# EAGLE board 8x8 LED Cathode Base V5 (EAGLE 6.1), part 1 of 2
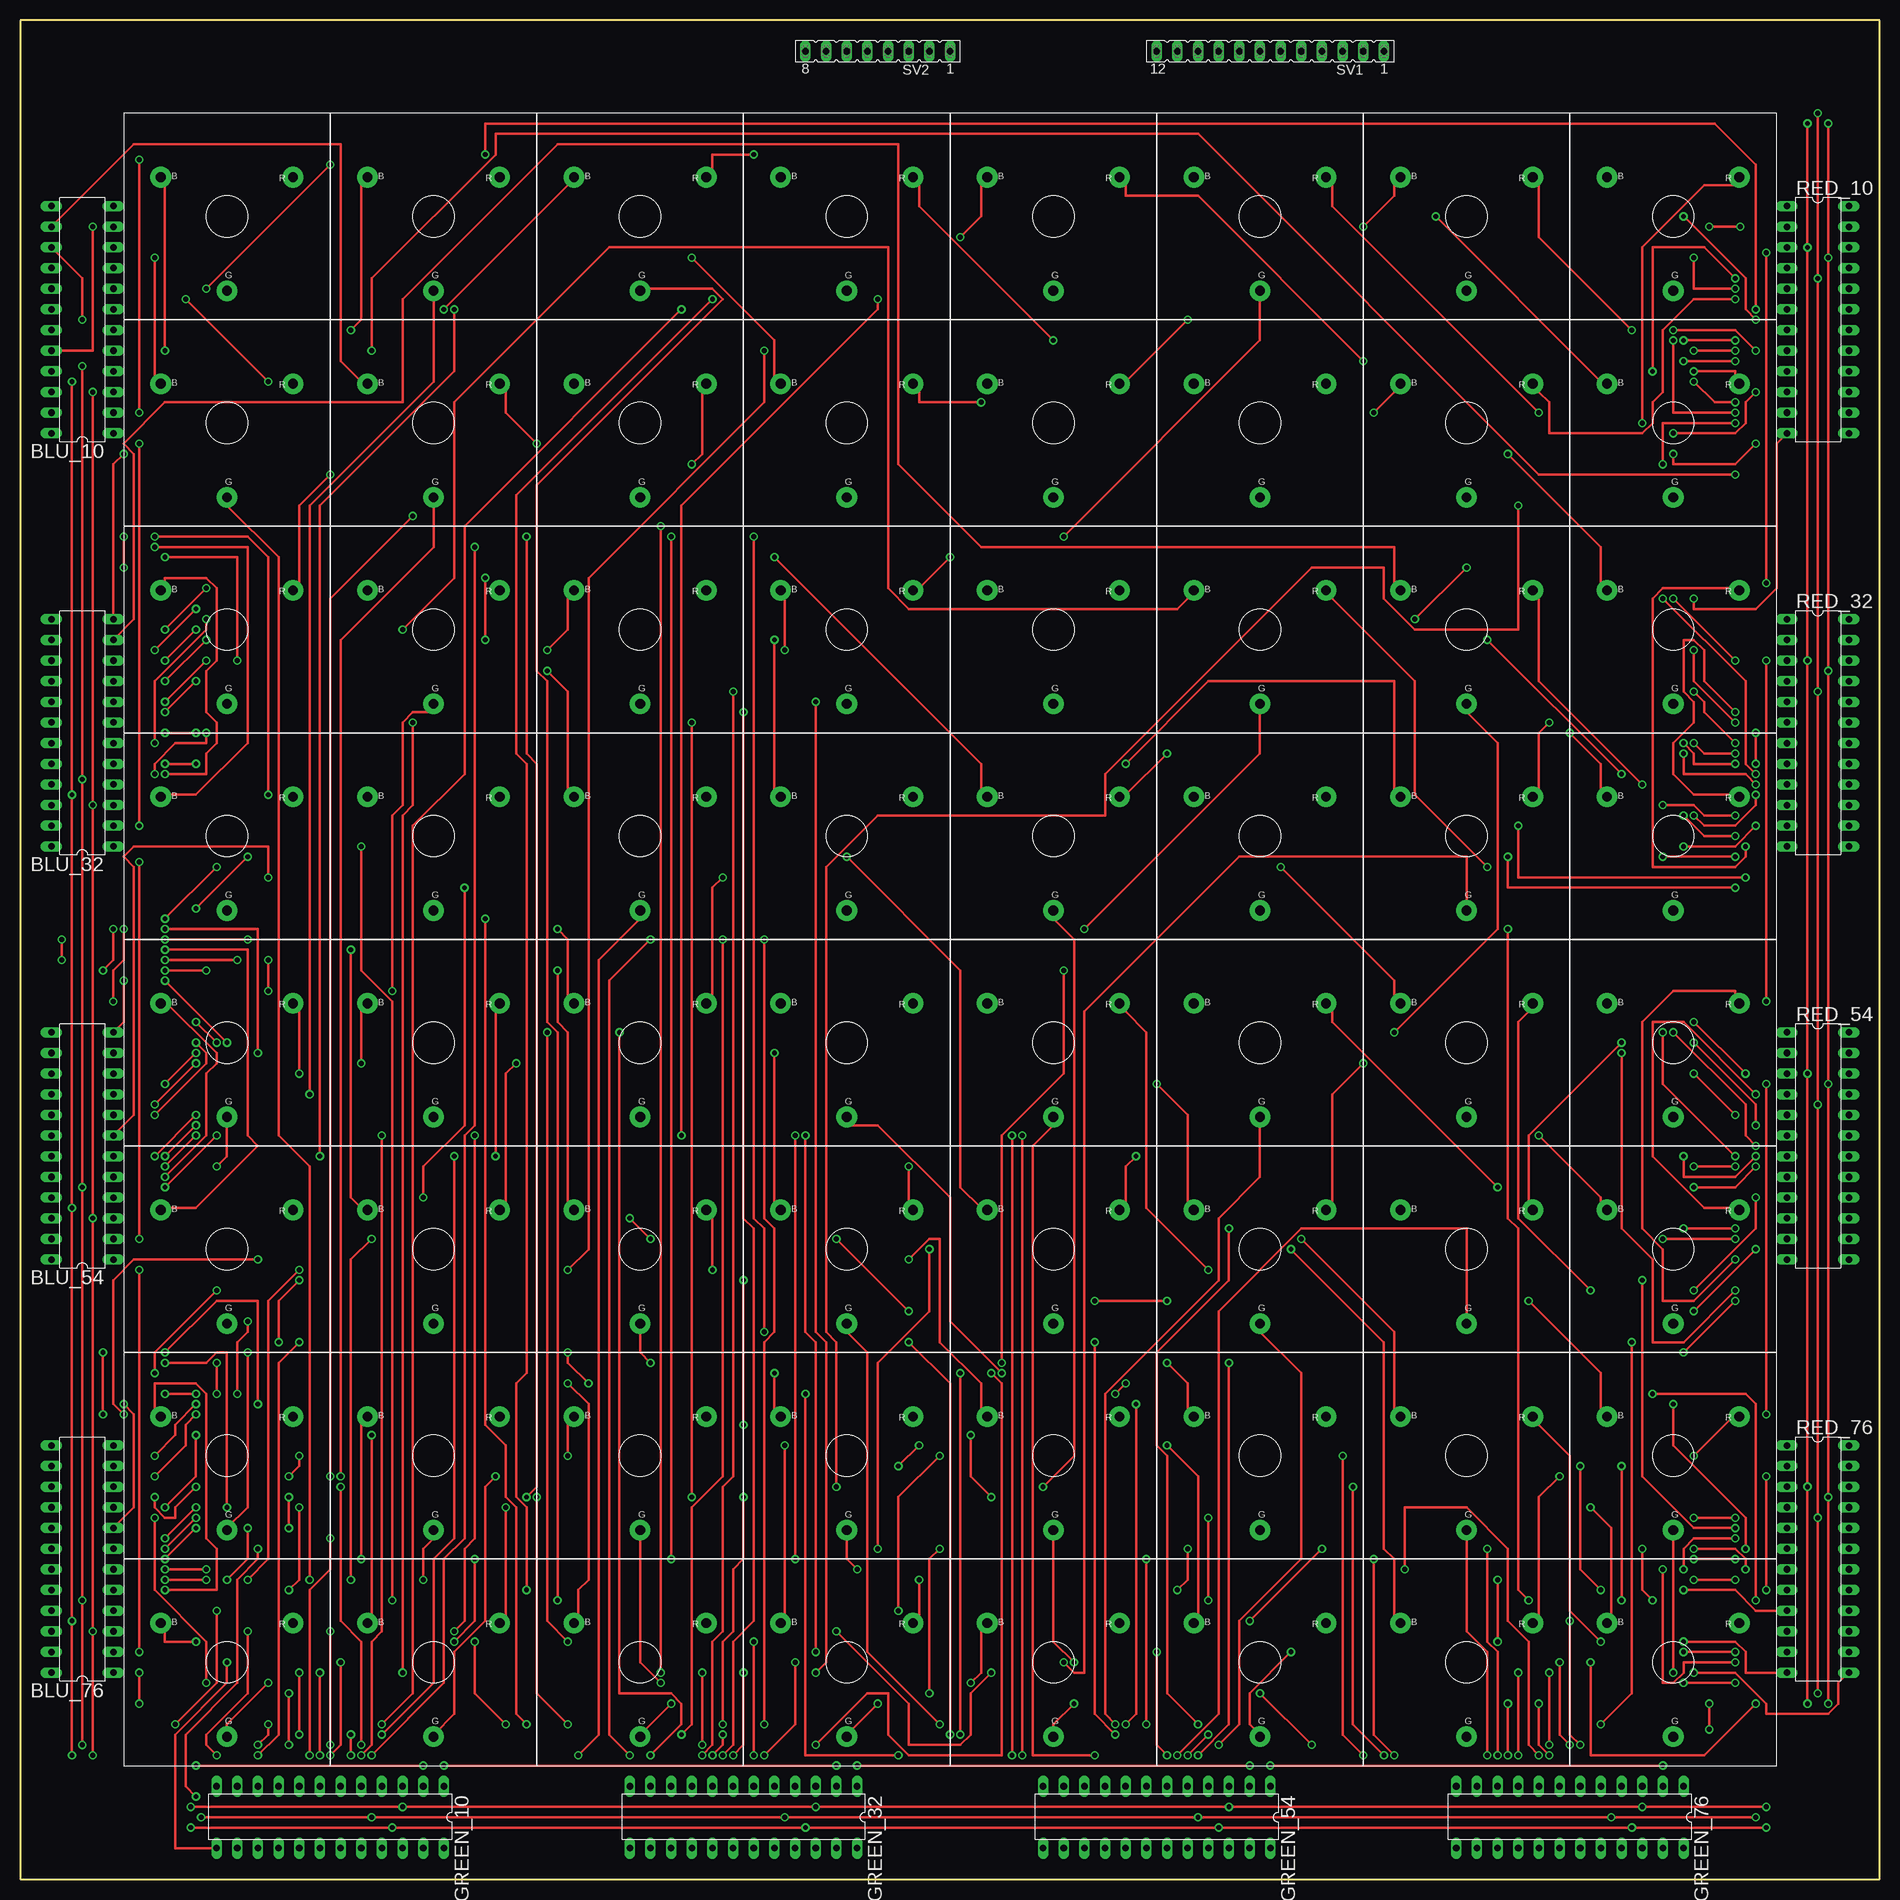
[diagram p1: board, top side]
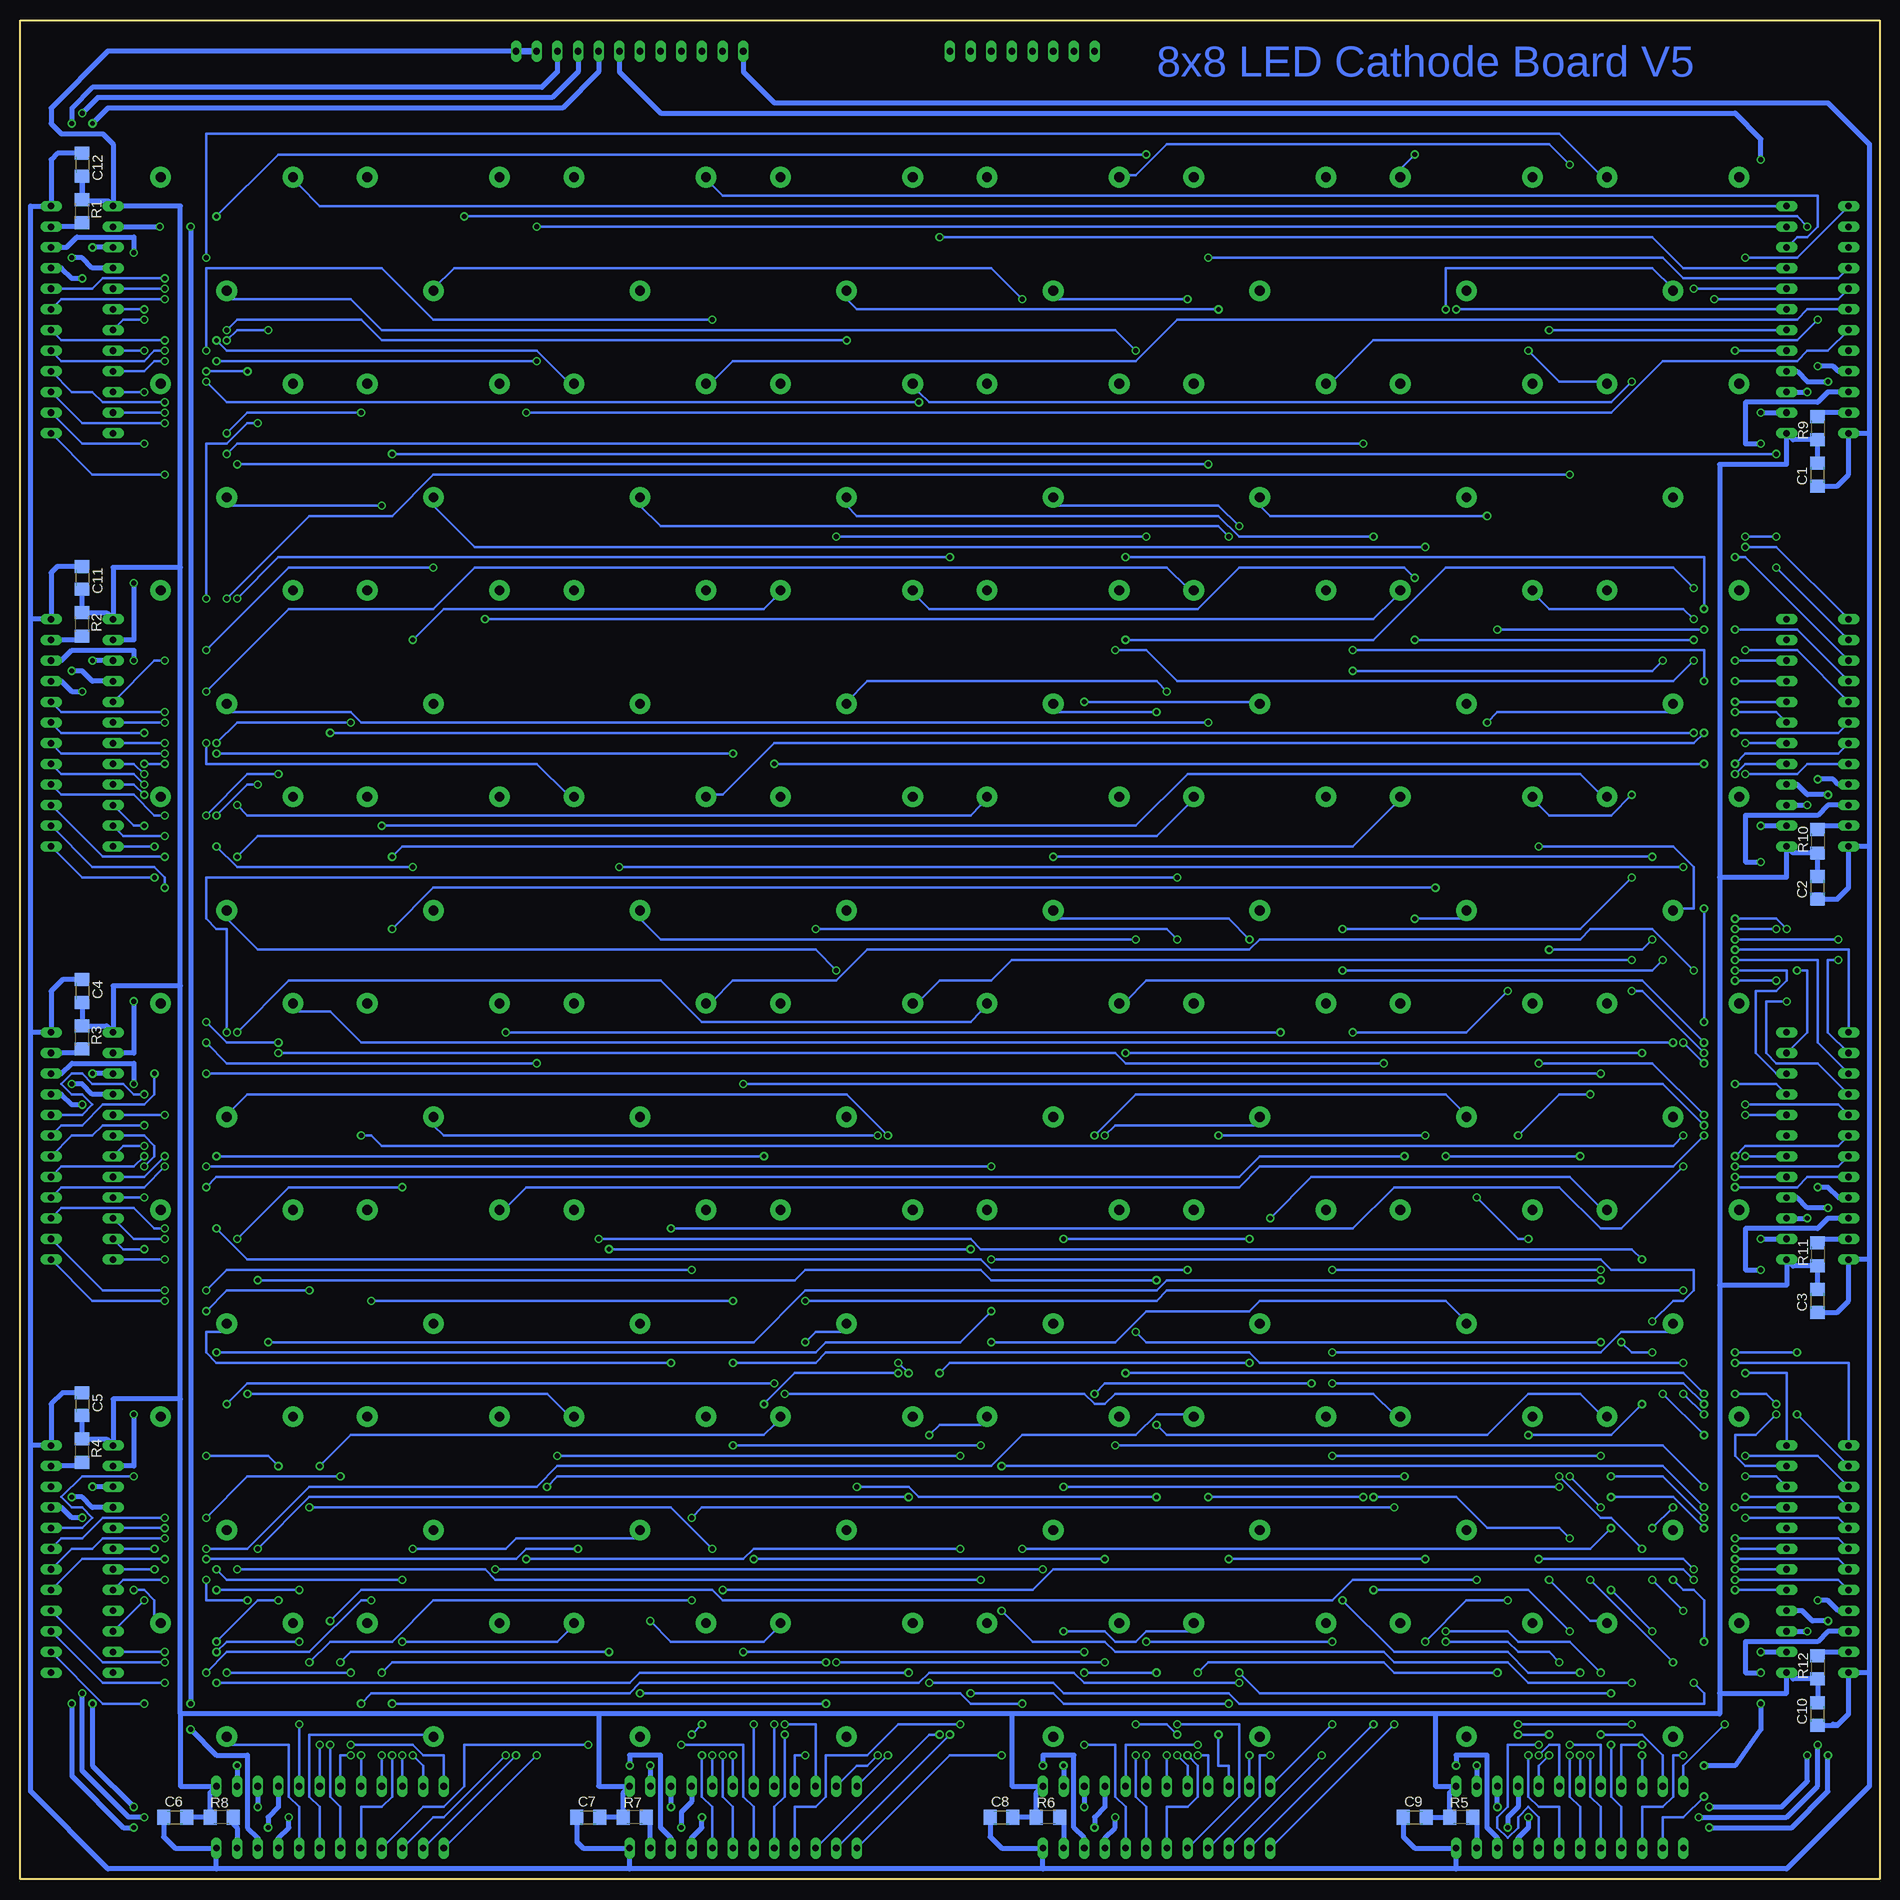
[diagram p2: board, bottom side, seen from below]

Size 228.58 x 228.58 mm. Coordinates in mm from the lower left corner, seen from the top.
Outline: 0,0 228.58,0 228.58,228.59 0,228.59 0,0
Copper layers (1*16): Top 0.035mm / dielectric 1.5mm / Bottom 0.035mm
Design rules: minimum track width 12mil, minimum drill 0.6mm, track to track 8mil, track to pad 8mil, pad to pad 8mil, via to via 8mil, smd to smd 8mil, copper to edge 40mil, drill to drill 8mil, minimum pad ring 10mil, minimum via ring 8mil, stop-mask expansion 4mil, vias tented up to drill 0mil, thermal gap 10mil

## Footprints (pad centres in the part's own frame; a part is rotated, then mirrored left to right if it is on the bottom)
DIL24-3 = drill 0.813 long: 1 -13.97,-3.81; 2 -11.43,-3.81; 3 -8.89,-3.81; 4 -6.35,-3.81; 5 -3.81,-3.81; 6 -1.27,-3.81; 7 1.27,-3.81; 8 3.81,-3.81; 9 6.35,-3.81; 10 8.89,-3.81; 11 11.43,-3.81; 12 13.97,-3.81; 13 13.97,3.81; 14 11.43,3.81; 15 8.89,3.81; 16 6.35,3.81; 17 3.81,3.81; 18 1.27,3.81; 19 -1.27,3.81; 20 -3.81,3.81; 21 -6.35,3.81; 22 -8.89,3.81; 23 -11.43,3.81; 24 -13.97,3.81
C1206 = smd 1.6 x 1.8: 1 -1.4,0; 2 1.4,0
R1206 = smd 1.6 x 1.803: 1 -1.422,0; 2 1.422,0
FE12 = drill 0.813 long: 1 -13.97,0; 2 -11.43,0; 3 -8.89,0; 4 -6.35,0; 5 -3.81,0; 6 -1.27,0; 7 1.27,0; 8 3.81,0; 9 6.35,0; 10 8.89,0; 11 11.43,0; 12 13.97,0
FE08 = drill 0.813 long: 1 -8.89,0; 2 -6.35,0; 3 -3.81,0; 4 -1.27,0; 5 1.27,0; 6 3.81,0; 7 6.35,0; 8 8.89,0
8X8_RGB_LED_120 = drill 1.2 pad 2.54: BLU_00 -97.028,93.726; BLU_01 -71.628,93.726; BLU_02 -46.228,93.726; BLU_03 -20.828,93.726; BLU_04 4.572,93.726; BLU_05 29.972,93.726; BLU_06 55.372,93.726; BLU_07 80.772,93.726; BLU_10 -97.028,68.326; BLU_11 -71.628,68.326; BLU_12 -46.228,68.326; BLU_13 -20.828,68.326; BLU_14 4.572,68.326; BLU_15 29.972,68.326; BLU_16 55.372,68.326; BLU_17 80.772,68.326; BLU_20 -97.028,42.926; BLU_21 -71.628,42.926; BLU_22 -46.228,42.926; BLU_23 -20.828,42.926; BLU_24 4.572,42.926; BLU_25 29.972,42.926; BLU_26 55.372,42.926; BLU_27 80.772,42.926; BLU_30 -97.028,17.526; BLU_31 -71.628,17.526; BLU_32 -46.228,17.526; BLU_33 -20.828,17.526; BLU_34 4.572,17.526; BLU_35 29.972,17.526; BLU_36 55.372,17.526; BLU_37 80.772,17.526; BLU_40 -97.028,-7.874; BLU_41 -71.628,-7.874; BLU_42 -46.228,-7.874; BLU_43 -20.828,-7.874; BLU_44 4.572,-7.874; BLU_45 29.972,-7.874; BLU_46 55.372,-7.874; BLU_47 80.772,-7.874; BLU_50 -97.028,-33.274; BLU_51 -71.628,-33.274; BLU_52 -46.228,-33.274; BLU_53 -20.828,-33.274; BLU_54 4.572,-33.274; BLU_55 29.972,-33.274; BLU_56 55.372,-33.274; BLU_57 80.772,-33.274; BLU_60 -97.028,-58.674; BLU_61 -71.628,-58.674; BLU_62 -46.228,-58.674; BLU_63 -20.828,-58.674; BLU_64 4.572,-58.674; BLU_65 29.972,-58.674; BLU_66 55.372,-58.674; BLU_67 80.772,-58.674; BLU_70 -97.028,-84.074; BLU_71 -71.628,-84.074; BLU_72 -46.228,-84.074; BLU_73 -20.828,-84.074; BLU_74 4.572,-84.074; BLU_75 29.972,-84.074; BLU_76 55.372,-84.074; BLU_77 80.772,-84.074; GRN_00 -88.9,79.756; GRN_01 -63.5,79.756; GRN_02 -38.1,79.756; GRN_03 -12.7,79.756; GRN_04 12.7,79.756; GRN_05 38.1,79.756; GRN_06 63.5,79.756; GRN_07 88.9,79.756; GRN_10 -88.9,54.356; GRN_11 -63.5,54.356; GRN_12 -38.1,54.356; GRN_13 -12.7,54.356; GRN_14 12.7,54.356; GRN_15 38.1,54.356; GRN_16 63.5,54.356; GRN_17 88.9,54.356; GRN_20 -88.9,28.956; GRN_21 -63.5,28.956; GRN_22 -38.1,28.956; GRN_23 -12.7,28.956; GRN_24 12.7,28.956; GRN_25 38.1,28.956; GRN_26 63.5,28.956; GRN_27 88.9,28.956; GRN_30 -88.9,3.556; GRN_31 -63.5,3.556; GRN_32 -38.1,3.556; GRN_33 -12.7,3.556; GRN_34 12.7,3.556; GRN_35 38.1,3.556; GRN_36 63.5,3.556; GRN_37 88.9,3.556; GRN_40 -88.9,-21.844; GRN_41 -63.5,-21.844; GRN_42 -38.1,-21.844; GRN_43 -12.7,-21.844; GRN_44 12.7,-21.844; GRN_45 38.1,-21.844; GRN_46 63.5,-21.844; GRN_47 88.9,-21.844; GRN_50 -88.9,-47.244; GRN_51 -63.5,-47.244; GRN_52 -38.1,-47.244; GRN_53 -12.7,-47.244; GRN_54 12.7,-47.244; GRN_55 38.1,-47.244; GRN_56 63.5,-47.244; GRN_57 88.9,-47.244; GRN_60 -88.9,-72.644; GRN_61 -63.5,-72.644; GRN_62 -38.1,-72.644; GRN_63 -12.7,-72.644; GRN_64 12.7,-72.644; GRN_65 38.1,-72.644; GRN_66 63.5,-72.644; GRN_67 88.9,-72.644; GRN_70 -88.9,-98.044; GRN_71 -63.5,-98.044; GRN_72 -38.1,-98.044; GRN_73 -12.7,-98.044; GRN_74 12.7,-98.044; GRN_75 38.1,-98.044; GRN_76 63.5,-98.044; GRN_77 88.9,-98.044; RED_00 -80.772,93.726; RED_01 -55.372,93.726; RED_02 -29.972,93.726; RED_03 -4.572,93.726; RED_04 20.828,93.726; RED_05 46.228,93.726; RED_06 71.628,93.726; RED_07 97.028,93.726; RED_10 -80.772,68.326; RED_11 -55.372,68.326; RED_12 -29.972,68.326; RED_13 -4.572,68.326; RED_14 20.828,68.326; RED_15 46.228,68.326; RED_16 71.628,68.326; RED_17 97.028,68.326; RED_20 -80.772,42.926; RED_21 -55.372,42.926; RED_22 -29.972,42.926; RED_23 -4.572,42.926; RED_24 20.828,42.926; RED_25 46.228,42.926; RED_26 71.628,42.926; RED_27 97.028,42.926; RED_30 -80.772,17.526; RED_31 -55.372,17.526; RED_32 -29.972,17.526; RED_33 -4.572,17.526; RED_34 20.828,17.526; RED_35 46.228,17.526; RED_36 71.628,17.526; RED_37 97.028,17.526; RED_40 -80.772,-7.874; RED_41 -55.372,-7.874; RED_42 -29.972,-7.874; RED_43 -4.572,-7.874; RED_44 20.828,-7.874; RED_45 46.228,-7.874; RED_46 71.628,-7.874; RED_47 97.028,-7.874; RED_50 -80.772,-33.274; RED_51 -55.372,-33.274; RED_52 -29.972,-33.274; RED_53 -4.572,-33.274; RED_54 20.828,-33.274; RED_55 46.228,-33.274; RED_56 71.628,-33.274; RED_57 97.028,-33.274; RED_60 -80.772,-58.674; RED_61 -55.372,-58.674; RED_62 -29.972,-58.674; RED_63 -4.572,-58.674; RED_64 20.828,-58.674; RED_65 46.228,-58.674; RED_66 71.628,-58.674; RED_67 97.028,-58.674; RED_70 -80.772,-84.074; RED_71 -55.372,-84.074; RED_72 -29.972,-84.074; RED_73 -4.572,-84.074; RED_74 20.828,-84.074; RED_75 46.228,-84.074; RED_76 71.628,-84.074; RED_77 97.028,-84.074

## Placement (x,y rotation side)
BLU_10  DM13A  [DIL24-3]  7.62,191.77 90 top
BLU_32  DM13A  [DIL24-3]  7.62,140.97 90 top
BLU_54  DM13A  [DIL24-3]  7.62,90.17 90 top
BLU_76  DM13A  [DIL24-3]  7.62,39.37 90 top
C1  105  [C1206]  7.62,172.72 90 bottom
C2  105  [C1206]  7.62,121.92 90 bottom
C3  105  [C1206]  7.62,71.12 90 bottom
C4  105  [C1206]  220.98,109.22 270 bottom
C5  105  [C1206]  220.98,58.42 270 bottom
C6  105  [C1206]  209.55,7.62 0 bottom
C7  105  [C1206]  158.75,7.62 0 bottom
C8  105  [C1206]  107.95,7.62 0 bottom
C9  105  [C1206]  57.15,7.62 0 bottom
C10  105  [C1206]  7.62,20.32 90 bottom
C11  105  [C1206]  220.98,160.02 270 bottom
C12  105  [C1206]  220.98,210.82 270 bottom
GREEN_10  DM13A  [DIL24-3]  38.1,7.62 180 top
GREEN_32  DM13A  [DIL24-3]  88.9,7.62 180 top
GREEN_54  DM13A  [DIL24-3]  139.7,7.62 180 top
GREEN_76  DM13A  [DIL24-3]  190.5,7.62 180 top
R1  2K7  [R1206]  220.98,205.1 270 bottom
R2  2K7  [R1206]  220.98,154.31 270 bottom
R3  2K7  [R1206]  220.98,103.5 270 bottom
R4  2K7  [R1206]  220.98,52.7 270 bottom
R5  2K7  [R1206]  51.44,7.62 0 bottom
R6  2K7  [R1206]  102.23,7.62 0 bottom
R7  2K7  [R1206]  153.03,7.62 0 bottom
R8  2K7  [R1206]  203.84,7.62 0 bottom
R9  2K7  [R1206]  7.62,178.44 90 bottom
R10  2K7  [R1206]  7.62,127.64 90 bottom
R11  2K7  [R1206]  7.62,76.83 90 bottom
R12  2K7  [R1206]  7.62,26.04 90 bottom
RED_10  DM13A  [DIL24-3]  220.98,191.77 270 top
RED_32  DM13A  [DIL24-3]  220.98,140.97 270 top
RED_54  DM13A  [DIL24-3]  220.98,90.17 270 top
RED_76  DM13A  [DIL24-3]  220.98,39.37 270 top
SV1  BOTTOM  [FE12]  153.67,224.79 180 top
SV2  [FE08]  105.41,224.79 180 top
U$1  8X8_RGB_COLUMN  [8X8_RGB_LED_120]  114.3,115.57 0 top

## Tracks (layer width: path | path; a pad name or v marks a point on that pad's centre or on a via)
BLANK  (via drill 0.6, 0.6 pad 1.02)
  Top 0.305: v7.62,186.06 v7.62,135.25 v7.62,85.09 v7.62,34.29 v7.62,16.51 | v22.23,7.62 v43.18,7.62 v93.98,7.62 v144.78,7.62 v195.58,7.62 v213.36,7.62 | v220.98,22.86 v220.98,44.45 v220.98,95.25 v220.98,146.05 v220.98,196.85 v220.98,217.17
  Bottom 0.61: BLU_10.21 5.08,185.42 5.71,186.06 v7.62,186.06 | BLU_32.21 5.08,134.62 5.71,135.25 v7.62,135.25 | BLU_76.21 5.08,33.02 6.35,34.29 v7.62,34.29 | BLU_54.21 5.08,83.82 6.35,85.09 v7.62,85.09 | v43.18,7.62 43.18,6.35 44.45,5.08 GREEN_10.21 | v22.23,7.62 11.43,7.62 7.62,11.43 v7.62,16.51 | GREEN_32.21 95.25,5.08 93.98,6.35 v93.98,7.62 | GREEN_54.21 146.05,5.08 144.78,6.35 v144.78,7.62 | GREEN_76.21 196.85,5.08 195.58,6.35 v195.58,7.62 | v213.36,7.62 215.26,7.62 220.98,13.34 v220.98,22.86 | v220.98,44.45 222.25,44.45 223.52,45.72 RED_76.21 | RED_54.21 223.52,96.52 222.25,95.25 v220.98,95.25 | RED_32.21 223.52,147.32 222.25,146.05 v220.98,146.05 | RED_10.21 223.52,198.12 222.25,196.85 v220.98,196.85 | SV1.4 160.02,222.25 163.19,219.07 219.07,219.07 v220.98,217.17
BLU_00  (via drill 0.6)
  Top 0.305: v17.78,187.96 17.78,208.28 U$1.BLU_00
  Bottom 0.305: v17.78,187.96 BLU_10.5
BLU_01  (via drill 0.6)
  Top 0.305: v40.64,190.5 41.91,191.77 41.91,208.28 U$1.BLU_01
  Bottom 0.305: v40.64,190.5 BLU_10.6
BLU_02  (via drill 0.6)
  Top 0.305: v52.07,193.04 67.31,208.28 U$1.BLU_02
  Bottom 0.305: v52.07,193.04 BLU_10.7
BLU_03  (via drill 0.6)
  Top 0.305: v38.1,210.82 v22.86,195.58
  Bottom 0.305: v22.86,195.58 BLU_10.8 | v38.1,210.82 40.64,213.36 87.63,213.36 91.44,209.55 92.71,209.55 U$1.BLU_03
BLU_04  (via drill 0.6)
  Top 0.305: v115.57,201.93 118.11,204.47 118.11,208.28 U$1.BLU_04
  Bottom 0.305: BLU_10.9 24.13,198.12 27.94,201.93 v115.57,201.93
BLU_05
  Bottom 0.305: BLU_10.10 10.16,201.93 8.89,201.93 7.62,203.2 7.62,207.01 142.24,207.01 143.51,208.28 U$1.BLU_05
BLU_06  (via drill 0.6)
  Top 0.305: v165.1,203.2 168.91,207.01 168.91,208.28 U$1.BLU_06
  Bottom 0.305: v165.1,203.2 BLU_10.11
BLU_07
  Bottom 0.305: BLU_10.12 191.77,205.74 194.31,208.28 U$1.BLU_07
BLU_10  (via drill 0.6)
  Top 0.305: v16.51,199.39 16.51,184.15 U$1.BLU_10
  Bottom 0.305: BLU_10.13 10.16,199.39 v16.51,199.39
BLU_11
  Top 0.305: BLU_10.14 13.97,213.36 39.37,213.36 39.37,186.69 41.91,184.15 U$1.BLU_11
BLU_12  (via drill 0.6)
  Top 0.305: BLU_10.15 7.62,196.85 v7.62,191.77
  Bottom 0.305: v7.62,191.77 10.16,189.23 62.23,189.23 67.31,184.15 U$1.BLU_12
BLU_13  (via drill 0.6)
  Top 0.305: v82.55,199.39 92.71,189.23 92.71,184.15 U$1.BLU_13
  Bottom 0.305: BLU_10.16 5.08,196.85 24.13,196.85 26.67,199.39 v82.55,199.39
BLU_14  (via drill 0.6)
  Top 0.305: v30.48,184.15 v20.32,194.31
  Bottom 0.305: BLU_10.17 5.08,194.31 v20.32,194.31 | v30.48,184.15 33.02,181.61 116.84,181.61 118.11,182.88 U$1.BLU_14
BLU_15
  Bottom 0.305: BLU_10.18 8.89,193.04 10.16,191.77 86.36,191.77 91.44,186.69 140.97,186.69 143.51,184.15 U$1.BLU_15
BLU_16  (via drill 0.6)
  Top 0.305: v166.37,180.34 168.91,182.88 U$1.BLU_16
  Bottom 0.305: BLU_10.19 6.35,187.96 8.89,187.96 10.16,186.69 26.67,186.69 33.02,180.34 v166.37,180.34
BLU_17  (via drill 0.6)
  Top 0.305: BLU_10.20 8.89,187.96 v8.89,203.2 | v173.99,204.47 194.31,184.15 U$1.BLU_17
  Bottom 0.305: v8.89,203.2 10.16,204.47 v173.99,204.47
BLU_20  (via drill 0.6)
  Top 0.305: v17.78,135.89 22.86,135.89 22.86,138.43 24.13,139.7 24.13,142.24 22.86,143.51 22.86,148.59 24.13,149.86 24.13,158.75 22.86,160.02 17.78,160.02 17.78,158.75 U$1.BLU_20
  Bottom 0.305: BLU_32.5 16.51,137.16 v17.78,135.89
BLU_21  (via drill 0.6)
  Top 0.305: v16.51,139.7 16.51,147.32 22.86,153.67 v22.86,154.94
  Bottom 0.305: v16.51,139.7 BLU_32.6 | v22.86,154.94 24.13,156.21 40.64,156.21 41.91,157.48 U$1.BLU_21
BLU_22  (via drill 0.6)
  Top 0.305: v21.59,147.32 v17.78,143.51 | v64.77,151.13 67.31,153.67 67.31,157.48 U$1.BLU_22
  Bottom 0.305: BLU_32.7 12.7,143.51 v17.78,143.51 | v21.59,147.32 21.59,151.13 v64.77,151.13
BLU_23  (via drill 0.6)
  Top 0.305: v22.86,149.86 v17.78,144.78 | v93.98,151.13 93.98,157.48 U$1.BLU_23
  Bottom 0.305: v17.78,144.78 BLU_32.8 | v22.86,149.86 25.4,147.32 86.36,147.32 90.17,151.13 v93.98,151.13
BLU_24  (via drill 0.6)
  Top 0.305: v22.86,152.4 v17.78,147.32 | v57.15,160.02 v57.15,152.4
  Bottom 0.305: v17.78,147.32 BLU_32.9 | v57.15,152.4 v22.86,152.4 | v57.15,160.02 58.42,161.29 78.74,161.29 83.82,156.21 116.84,156.21 118.11,157.48 U$1.BLU_24
BLU_25  (via drill 0.6)
  Top 0.305: v21.59,153.67 v17.78,149.86 | v46.99,153.67 53.34,160.02 53.34,181.61 72.39,200.66 106.68,200.66 106.68,158.75 109.22,156.21 142.24,156.21 143.51,157.48 U$1.BLU_25
  Bottom 0.305: v17.78,149.86 BLU_32.10 | v46.99,153.67 v21.59,153.67
BLU_26
  Top 0.305: BLU_32.11 13.97,154.94 13.97,175.26 12.7,176.53 17.78,181.61 46.99,181.61 46.99,194.31 66.04,213.36 107.95,213.36 107.95,173.99 118.11,163.83 168.91,163.83 168.91,158.75 U$1.BLU_26
BLU_27  (via drill 0.6)
  Top 0.305: BLU_32.12 11.43,173.99 v12.7,175.26 | v182.88,175.26 194.31,163.83 194.31,158.75 U$1.BLU_27
  Bottom 0.305: v182.88,175.26 v12.7,175.26
BLU_30  (via drill 0.6)
  Top 0.305: v16.51,163.83 27.94,163.83 27.94,139.7 21.59,133.35 17.78,133.35 U$1.BLU_30
  Bottom 0.305: BLU_32.13 12.7,163.83 v16.51,163.83
BLU_31  (via drill 0.6)
  Top 0.305: v12.7,165.1 v12.7,161.29 | v16.51,165.1 27.94,165.1 30.48,162.56 v30.48,133.35
  Bottom 0.305: v12.7,161.29 BLU_32.14 | v16.51,165.1 v12.7,165.1 | v30.48,133.35 33.02,130.81 40.64,130.81 41.91,132.08 U$1.BLU_31
BLU_32  (via drill 0.6)
  Top 0.305: v17.78,162.56 26.67,162.56 v26.67,149.86 | v64.77,148.59 67.31,146.05 67.31,133.35 U$1.BLU_32
  Bottom 0.305: BLU_32.15 16.51,162.56 v17.78,162.56 | v26.67,149.86 27.94,148.59 v64.77,148.59
BLU_32_DATA  (via drill 0.6 pad 1.02)
  Top 0.305: v14.61,176.53 v14.61,129.54
  Bottom 0.61: BLU_10.22 6.35,182.88 7.62,181.61 16.51,181.61 16.51,176.53 v14.61,176.53 | v14.61,129.54 BLU_32.2
BLU_33  (via drill 0.6)
  Top 0.305: v22.86,158.75 v17.78,153.67 | v92.71,152.4 92.71,133.35 U$1.BLU_33
  Bottom 0.305: BLU_32.16 10.16,153.67 v17.78,153.67 | v22.86,158.75 25.4,161.29 53.34,161.29 62.23,152.4 v92.71,152.4
BLU_34  (via drill 0.6)
  Top 0.305: v21.59,156.21 v16.51,151.13 | v92.71,162.56 118.11,137.16 118.11,133.35 U$1.BLU_34
  Bottom 0.305: BLU_32.17 10.16,151.13 v16.51,151.13 | v21.59,156.21 21.59,162.56 v92.71,162.56
BLU_35  (via drill 0.6)
  Top 0.305: v21.59,140.97 v17.78,140.97
  Bottom 0.305: BLU_32.18 5.08,140.97 v17.78,140.97 | v21.59,140.97 22.86,139.7 135.89,139.7 142.24,133.35 143.51,133.35 U$1.BLU_35
BLU_36  (via drill 0.6)
  Top 0.305: v21.59,137.16 v17.78,137.16 | v135.89,137.16 146.05,147.32 168.91,147.32 168.91,133.35 U$1.BLU_36
  Bottom 0.305: BLU_32.19 5.08,138.43 16.51,138.43 v17.78,137.16 | v135.89,137.16 v21.59,137.16
BLU_37  (via drill 0.6)
  Top 0.305: v16.51,135.89 16.51,137.16 19.05,139.7 22.86,139.7 v22.86,140.97 | v190.5,140.97 194.31,137.16 194.31,133.35 U$1.BLU_37
  Bottom 0.305: BLU_32.20 8.89,137.16 10.16,135.89 v16.51,135.89 | v190.5,140.97 v22.86,140.97
BLU_40  (via drill 0.6)
  Top 0.305: v17.78,86.36 22.86,91.44 22.86,99.06 24.13,100.33 24.13,101.6 17.78,107.95 U$1.BLU_40
  Bottom 0.305: v17.78,86.36 BLU_54.5
BLU_41  (via drill 0.6)
  Top 0.305: v21.59,93.98 v16.51,88.9 | v41.91,100.33 41.91,106.68 U$1.BLU_41
  Bottom 0.305: v16.51,88.9 BLU_54.6 | v21.59,93.98 27.94,100.33 v41.91,100.33
BLU_42  (via drill 0.6)
  Top 0.305: BLU_54.7 13.97,93.98 13.97,124.46 12.7,125.73 13.97,127 30.48,127 v30.48,123.19 | v66.04,116.84 67.31,115.57 67.31,107.95 U$1.BLU_42
  Bottom 0.305: v30.48,123.19 36.83,116.84 v66.04,116.84
BLU_43  (via drill 0.6)
  Top 0.305: v16.51,93.98 22.86,100.33 22.86,101.6 v21.59,102.87
  Bottom 0.305: v16.51,93.98 BLU_54.8 | v21.59,102.87 29.21,110.49 90.17,110.49 92.71,107.95 U$1.BLU_43
BLU_44  (via drill 0.6)
  Top 0.305: v21.59,101.6 v17.78,97.79 | v30.48,113.03 v30.48,109.22
  Bottom 0.305: BLU_54.9 12.7,97.79 v17.78,97.79 | v21.59,101.6 29.21,109.22 v30.48,109.22 | v30.48,113.03 106.68,113.03 109.22,110.49 115.57,110.49 118.11,107.95 U$1.BLU_44
BLU_45  (via drill 0.6)
  Top 0.305: v22.86,111.76 v17.78,111.76
  Bottom 0.305: BLU_54.10 12.7,99.06 15.24,101.6 15.24,109.22 12.7,109.22 11.43,110.49 11.43,111.76 v17.78,111.76 | v22.86,111.76 27.94,116.84 35.56,116.84 36.83,115.57 76.2,115.57 77.47,114.3 124.46,114.3 128.27,110.49 140.97,110.49 143.51,107.95 U$1.BLU_45
BLU_46  (via drill 0.6)
  Top 0.305: v10.16,111.76 11.43,113.03 v11.43,116.84 | v24.13,124.46 v17.78,118.11 | v154.94,124.46 168.91,110.49 168.91,107.95 U$1.BLU_46
  Bottom 0.305: BLU_54.11 8.89,104.14 8.89,111.76 v10.16,111.76 | v11.43,116.84 12.7,118.11 v17.78,118.11 | v154.94,124.46 v24.13,124.46
BLU_47  (via drill 0.6)
  Top 0.305: BLU_54.12 12.7,105.41 v12.7,110.49 | v25.4,102.87 v17.78,110.49
  Bottom 0.305: v17.78,110.49 v12.7,110.49 | v25.4,102.87 186.69,102.87 190.5,106.68 194.31,106.68 U$1.BLU_47
BLU_50  (via drill 0.6)
  Top 0.305: v17.78,114.3 27.94,114.3 27.94,91.44 29.21,90.17 21.59,82.55 17.78,82.55 U$1.BLU_50
  Bottom 0.305: BLU_54.13 3.81,114.3 v17.78,114.3
BLU_51  (via drill 0.6)
  Top 0.305: v5.08,115.57 v5.08,113.03 | v27.94,115.57 v17.78,115.57 | v40.64,114.3 40.64,83.82 41.91,82.55 U$1.BLU_51
  Bottom 0.305: BLU_54.14 6.35,104.14 6.35,113.03 v5.08,113.03 | v17.78,115.57 v5.08,115.57 | v27.94,115.57 29.21,114.3 v40.64,114.3
BLU_52  (via drill 0.6)
  Top 0.305: v26.67,113.03 v17.78,113.03 | v66.04,111.76 66.04,105.41 67.31,104.14 67.31,82.55 U$1.BLU_52
  Bottom 0.305: BLU_54.15 7.62,102.87 7.62,113.03 v17.78,113.03 | v26.67,113.03 27.94,111.76 v66.04,111.76
BLU_53  (via drill 0.6)
  Top 0.305: v11.43,107.95 11.43,111.76 12.7,113.03 v12.7,116.84 | v17.78,116.84 29.21,116.84 v29.21,101.6 | v92.71,101.6 92.71,82.55 U$1.BLU_53
  Bottom 0.305: BLU_54.16 7.62,100.33 12.7,100.33 13.97,101.6 13.97,107.95 v11.43,107.95 | v17.78,116.84 v12.7,116.84 | v92.71,101.6 v29.21,101.6
BLU_54  (via drill 0.6)
  Top 0.305: v21.59,100.33 v16.51,95.25 | v21.59,105.41 v24.13,102.87 | v27.94,125.73 v21.59,119.38 | v101.6,125.73 115.57,111.76 115.57,85.09 118.11,82.55 U$1.BLU_54
  Bottom 0.305: BLU_54.17 5.08,95.25 v16.51,95.25 | v24.13,102.87 v21.59,100.33 | v21.59,119.38 v21.59,105.41 | v101.6,125.73 v27.94,125.73
BLU_54_DATA  (via drill 0.6 pad 1.02)
  Top 0.305: v14.61,125.09 v14.61,78.74
  Bottom 0.61: BLU_32.22 6.35,132.08 7.62,130.81 16.51,130.81 16.51,125.09 v14.61,125.09 | v14.61,78.74 BLU_54.2
BLU_55  (via drill 0.6)
  Top 0.305: v21.59,92.71 v17.78,88.9 | v139.7,97.79 143.51,93.98 143.51,82.55 U$1.BLU_55
  Bottom 0.305: BLU_54.18 5.08,90.17 16.51,90.17 v17.78,88.9 | v21.59,92.71 26.67,97.79 v139.7,97.79
BLU_56  (via drill 0.6)
  Top 0.305: v21.59,91.44 v17.78,87.63
  Bottom 0.305: BLU_54.19 5.08,87.63 v17.78,87.63 | v21.59,91.44 25.4,87.63 76.2,87.63 78.74,85.09 166.37,85.09 168.91,82.55 U$1.BLU_56
BLU_57  (via drill 0.6)
  Top 0.305: v24.13,91.44 v17.78,85.09 | v186.69,91.44 194.31,83.82 194.31,82.55 U$1.BLU_57
  Bottom 0.305: BLU_54.20 8.89,86.36 10.16,85.09 v17.78,85.09 | v24.13,91.44 25.4,90.17 184.15,90.17 185.42,91.44 v186.69,91.44
BLU_60  (via drill 0.6)
  Top 0.305: v17.78,35.56 24.13,35.56 24.13,40.64 22.86,41.91 22.86,59.69 21.59,60.96 16.51,60.96 16.51,57.15 U$1.BLU_60
  Bottom 0.305: v17.78,35.56 BLU_76.5
BLU_61  (via drill 0.6)
  Top 0.305: v22.86,38.1 v17.78,38.1 | v41.91,39.37 41.91,55.88 U$1.BLU_61
  Bottom 0.305: v17.78,38.1 BLU_76.6 | v22.86,38.1 24.13,39.37 v41.91,39.37
BLU_62  (via drill 0.6)
  Top 0.305: v21.59,44.45 v17.78,40.64 | v33.02,49.53 34.29,50.8 v34.29,52.07 | v67.31,52.07 67.31,55.88 U$1.BLU_62
  Bottom 0.305: v17.78,40.64 BLU_76.7 | v21.59,44.45 26.67,49.53 v33.02,49.53 | v67.31,52.07 v34.29,52.07
BLU_63  (via drill 0.6)
  Top 0.305: BLU_76.8 13.97,45.72 13.97,57.15 v12.7,58.42 | v21.59,59.69 v17.78,59.69 | v92.71,62.23 92.71,57.15 U$1.BLU_63
  Bottom 0.305: v12.7,58.42 13.97,59.69 v17.78,59.69 | v21.59,59.69 24.13,62.23 v92.71,62.23
BLU_64  (via drill 0.6)
  Top 0.305: v17.78,45.72 21.59,49.53 v21.59,54.61 | v26.67,59.69 26.67,66.04 27.94,67.31 v27.94,68.58 | v109.22,76.2 111.76,78.74 113.03,78.74 113.03,66.04 118.11,60.96 118.11,57.15 U$1.BLU_64
  Bottom 0.305: v17.78,45.72 BLU_76.9 | v26.67,59.69 v21.59,54.61 | v27.94,68.58 25.4,71.12 24.13,71.12 22.86,72.39 22.86,74.93 33.02,74.93 34.29,76.2 v109.22,76.2
BLU_65  (via drill 0.6)
  Top 0.305: v16.51,49.53 20.32,53.34 20.32,55.88 v21.59,57.15 | v24.13,63.5 v24.13,59.69 | v140.97,63.5 143.51,60.96 143.51,57.15 U$1.BLU_65
  Bottom 0.305: BLU_76.10 12.7,49.53 v16.51,49.53 | v24.13,59.69 v21.59,57.15 | v24.13,63.5 76.2,63.5 77.47,64.77 129.54,64.77 130.81,63.5 v140.97,63.5
BLU_66  (via drill 0.6)
  Top 0.305: v12.7,57.15 11.43,58.42 11.43,73.66 13.97,76.2 v29.21,76.2 | v157.48,78.74 168.91,67.31 168.91,57.15 U$1.BLU_66
  Bottom 0.305: BLU_76.11 16.51,50.8 17.78,52.07 17.78,54.61 15.24,54.61 v12.7,57.15 | v29.21,76.2 30.48,77.47 110.49,77.47 111.76,78.74 v157.48,78.74
BLU_67  (via drill 0.6)
  Top 0.305: v16.51,62.23 16.51,64.77 v24.13,72.39 | v140.97,71.12 v132.08,71.12 | v185.42,71.12 194.31,62.23 194.31,57.15 U$1.BLU_67
  Bottom 0.305: BLU_76.12 11.43,62.23 v16.51,62.23 | v24.13,72.39 87.63,72.39 88.9,71.12 v132.08,71.12 | v185.42,71.12 v140.97,71.12
BLU_70  (via drill 0.6)
  Top 0.305: v17.78,63.5 22.86,63.5 24.13,64.77 25.4,64.77 v25.4,45.72 | v27.94,43.18 27.94,39.37 v25.4,36.83 | v21.59,29.21 17.78,29.21 17.78,30.48 U$1.BLU_70
  Bottom 0.305: BLU_76.13 3.81,63.5 v17.78,63.5 | v27.94,43.18 v25.4,45.72 | v25.4,36.83 24.13,35.56 22.86,35.56 21.59,34.29 v21.59,29.21
BLU_71  (via drill 0.6)
  Top 0.305: v10.16,64.77 v10.16,57.15 | v17.78,64.77 24.13,71.12 29.21,71.12 v29.21,58.42 | v43.18,54.61 43.18,31.75 U$1.BLU_71
  Bottom 0.305: v10.16,57.15 BLU_76.14 | v17.78,64.77 v10.16,64.77 | v29.21,58.42 33.02,54.61 v43.18,54.61
BLU_72  (via drill 0.6)
  Top 0.305: v16.51,52.07 19.05,54.61 19.05,55.88 v21.59,58.42 | v67.31,60.96 69.85,58.42 69.85,36.83 68.58,35.56 68.58,31.75 U$1.BLU_72
  Bottom 0.305: BLU_76.15 7.62,52.07 v16.51,52.07 | v21.59,58.42 24.13,60.96 v67.31,60.96
BLU_73  (via drill 0.6)
  Top 0.305: v16.51,46.99 16.51,45.72 17.78,44.45 19.05,44.45 19.05,45.72 v21.59,48.26 | v93.98,53.34 93.98,31.75 U$1.BLU_73
  Bottom 0.305: BLU_76.16 5.08,46.99 v16.51,46.99 | v21.59,48.26 26.67,53.34 v93.98,53.34
BLU_74  (via drill 0.6)
  Top 0.305: v16.51,44.45 16.51,35.56 22.86,29.21 v22.86,24.13 | v116.84,24.13 118.11,25.4 118.11,30.48 U$1.BLU_74
  Bottom 0.305: BLU_76.17 5.08,44.45 v16.51,44.45 | v22.86,24.13 21.59,22.86 21.59,21.59 78.74,21.59 80.01,22.86 100.33,22.86 101.6,24.13 v116.84,24.13
BLU_75  (via drill 0.6)
  Top 0.305: v21.59,45.72 v17.78,41.91 | v110.49,53.34 v107.95,50.8 | v140.97,53.34 144.78,49.53 144.78,31.75 U$1.BLU_75
  Bottom 0.305: BLU_76.18 5.08,41.91 v17.78,41.91 | v21.59,45.72 26.67,50.8 v107.95,50.8 | v140.97,53.34 v110.49,53.34
BLU_76  (via drill 0.6)
  Top 0.305: v21.59,43.18 v17.78,39.37 | v33.02,43.18 v33.02,46.99 | v105.41,40.64 105.41,63.5 111.76,69.85 v111.76,77.47 | v156.21,77.47 167.64,66.04 167.64,40.64 168.91,39.37 168.91,31.75 U$1.BLU_76
  Bottom 0.305: BLU_76.19 5.08,39.37 v17.78,39.37 | v21.59,43.18 25.4,46.99 v33.02,46.99 | v33.02,43.18 35.56,40.64 v105.41,40.64 | v156.21,77.47 v111.76,77.47
BLU_76_DATA  (via drill 0.6 pad 1.02)
  Top 0.305: v14.61,74.93 v14.61,27.94
  Bottom 0.61: BLU_54.22 6.35,81.28 7.62,80.01 16.51,80.01 16.51,74.93 v14.61,74.93 | v14.61,27.94 BLU_76.2
BLU_77  (via drill 0.6)
  Top 0.305: v22.86,36.83 v17.78,36.83 | v142.24,35.56 143.51,36.83 v143.51,40.64 | v193.04,45.72 195.58,43.18 195.58,31.75 U$1.BLU_77
  Bottom 0.305: BLU_76.20 5.08,36.83 v17.78,36.83 | v22.86,36.83 24.13,38.1 101.6,38.1 104.14,35.56 v142.24,35.56 | v143.51,40.64 148.59,45.72 v193.04,45.72
BLU_IN  (via drill 0.6 pad 1.02)
  Top 0.305: v14.61,211.46 v14.61,180.34
  Bottom 0.61: v14.61,180.34 BLU_10.2 | SV1.6 154.94,222.25 149.86,217.17 17.78,217.17 14.61,214 v14.61,211.46
BLU_OUT  (via drill 0.6 pad 1.02)
  Top 0.305: v14.61,25.4 v14.61,21.59 | v21.59,13.97 v49.53,13.97
  Bottom 0.61: BLU_76.22 6.35,30.48 7.62,29.21 16.51,29.21 16.51,25.4 v14.61,25.4 | v14.61,21.59 14.61,18.41 17.78,13.97 v21.59,13.97 | v49.53,13.97 GREEN_10.2
CLOCK  (via drill 0.6, 0.6 pad 1.02)
  Top 0.305: v8.89,182.88 v8.89,132.08 v8.89,81.28 v8.89,30.48 v8.89,15.24 | v20.95,8.89 v46.99,8.89 v97.79,8.89 v148.59,8.89 v199.39,8.89 v214.63,8.89 | v219.71,21.59 v219.71,48.26 v219.71,99.06 v219.71,149.86 v219.71,200.66 v219.71,215.9
  Bottom 0.61: BLU_10.3 v8.89,182.88 | BLU_32.3 v8.89,132.08 | BLU_54.3 v8.89,81.28 | BLU_76.3 v8.89,30.48 | v46.99,8.89 GREEN_10.3 | v20.95,8.89 12.06,8.89 8.89,12.06 v8.89,15.24 | GREEN_32.3 v97.79,8.89 | GREEN_54.3 v148.59,8.89 | GREEN_76.3 v199.39,8.89 | RED_76.3 v219.71,48.26 | v219.71,21.59 219.71,13.97 v214.63,8.89 | RED_54.3 v219.71,99.06 | RED_32.3 v219.71,149.86 | RED_10.3 v219.71,200.66 | SV1.5 157.48,222.25 161.93,217.81 217.81,217.81 v219.71,215.9
GND
  Bottom 0.61: C1.2 R9.1 10.64,177.01 BLU_10.1 11.43,173.99 19.68,173.99 19.68,123.19 | C2.2 R10.1 10.64,126.21 BLU_32.1 11.43,123.19 19.68,123.19 | C3.2 R11.1 10.64,75.41 BLU_54.1 11.43,73.03 19.68,73.03 | C10.2 R12.1 10.64,24.61 BLU_76.1 11.43,22.86 19.68,22.86 | 19.68,123.19 19.68,73.03 | 19.68,73.03 19.68,22.86 | 19.68,22.86 19.68,20.32 54.61,20.32 | 54.61,20.32 54.61,11.43 GREEN_10.1 52.86,10.64 R5.1 C9.2 | C8.2 R6.1 103.66,10.64 GREEN_32.1 106.68,11.43 106.68,20.32 | 54.61,20.32 106.68,20.32 | 106.68,20.32 157.48,20.32 | 157.48,20.32 157.48,11.43 GREEN_54.1 154.46,10.64 R7.1 C7.2 | C6.2 R8.1 205.26,10.64 GREEN_76.1 208.91,11.43 208.91,20.32 | 157.48,20.32 208.91,20.32 | 208.91,20.32 208.91,59.05 | 208.91,59.05 208.91,109.86 | 208.91,109.86 208.91,161.29 | 208.91,161.29 208.91,205.74 RED_10.1 | 208.91,59.05 217.17,59.05 RED_76.1 217.96,54.13 R4.1 C5.2 | R3.1 217.96,104.93 RED_54.1 217.17,109.86 208.91,109.86 | R3.1 220.98,105.41 | C4.2 R3.1 | C11.2 R2.1 217.96,155.73 RED_32.1 217.17,161.29 208.91,161.29 | R1.1 C12.2 220.98,206.38 217.81,206.38 RED_10.1 | SV1.1 217.81,224.79 224.79,217.81 224.79,215.9 223.52,214.63 218.44,214.63 217.17,213.36 RED_10.1
  Bottom 0.813: SV1.2 SV1.1
GRN_00  (via drill 0.6)
  Top 0.305: v40.64,17.78 v40.64,15.24 | v44.45,17.78 50.8,24.13 50.8,39.37 53.34,41.91 v53.34,88.9 | v36.83,88.9 36.83,168.91 53.34,185.42 v53.34,193.04
  Bottom 0.305: v40.64,15.24 41.91,13.97 41.91,12.7 GREEN_10.5 | v44.45,17.78 v40.64,17.78 | v36.83,88.9 v53.34,88.9 | v53.34,193.04 53.34,198.12 27.94,198.12 25.4,195.58 U$1.GRN_00
GRN_01  (via drill 0.6)
  Top 0.305: v41.91,15.24 43.18,16.51 43.18,29.21 44.45,30.48 v44.45,91.44 | v35.56,96.52 35.56,168.91 50.8,184.15 U$1.GRN_01
  Bottom 0.305: GREEN_10.6 39.37,16.51 40.64,16.51 v41.91,15.24 | v44.45,91.44 39.37,96.52 v35.56,96.52
GRN_02  (via drill 0.6)
  Top 0.305: v36.83,25.4 v36.83,15.24 | v66.04,34.29 66.04,104.14 64.77,105.41 64.77,147.32 63.5,148.59 63.5,171.45 86.36,194.31 85.09,195.58 76.2,195.58 U$1.GRN_02
  Bottom 0.305: v36.83,15.24 GREEN_10.7 | v36.83,25.4 43.18,25.4 45.72,27.94 59.69,27.94 v66.04,34.29
GRN_03  (via drill 0.6)
  Top 0.305: v38.1,30.48 v38.1,16.51 | v62.23,35.56 62.23,45.72 60.96,46.99 60.96,60.96 62.23,62.23 62.23,137.16 60.96,138.43 60.96,170.18 v85.09,194.31
  Bottom 0.305: GREEN_10.8 34.29,16.51 v38.1,16.51 | v38.1,30.48 43.18,35.56 v62.23,35.56 | v85.09,194.31 101.6,194.31 U$1.GRN_03
GRN_04  (via drill 0.6)
  Top 0.305: v29.21,16.51 30.48,17.78 v30.48,19.05 | v44.45,19.05 48.26,22.86 48.26,129.54 54.61,135.89 54.61,166.37 v81.28,193.04
  Bottom 0.305: GREEN_10.9 31.75,16.51 v29.21,16.51 | v44.45,19.05 v30.48,19.05 | v81.28,193.04 125.73,193.04 127,194.31 U$1.GRN_04
GRN_05  (via drill 0.6)
  Top 0.305: v29.21,15.24 31.75,17.78 31.75,63.5 v34.29,66.04 | v91.44,67.31 91.44,80.01 90.17,81.28 v90.17,165.1 | v128.27,165.1 152.4,189.23 U$1.GRN_05
  Bottom 0.305: v29.21,15.24 GREEN_10.10 | v34.29,66.04 90.17,66.04 v91.44,67.31 | v128.27,165.1 v90.17,165.1
GRN_06  (via drill 0.6)
  Top 0.305: v34.29,25.4 v34.29,17.78 | v53.34,30.48 54.61,31.75 54.61,40.64 55.88,41.91 v55.88,91.44 | v81.28,91.44 81.28,168.91 105.41,193.04 v105.41,194.31
  Bottom 0.305: GREEN_10.11 26.67,15.24 29.21,17.78 v34.29,17.78 | v34.29,25.4 38.1,29.21 44.45,29.21 45.72,30.48 v53.34,30.48 | v81.28,91.44 v55.88,91.44 | v105.41,194.31 109.22,198.12 175.26,198.12 177.8,195.58 U$1.GRN_06
GRN_07  (via drill 0.6)
  Top 0.305: v19.05,19.05 24.13,24.13 v24.13,33.02 | v27.94,36.83 30.48,39.37 30.48,71.12 v34.29,74.93 | v67.31,74.93 69.85,77.47 69.85,160.02 91.44,181.61 v91.44,187.96
  Bottom 0.305: GREEN_10.12 24.13,13.97 v19.05,19.05 | v27.94,36.83 v24.13,33.02 | v67.31,74.93 v34.29,74.93 | v91.44,187.96 93.98,190.5 184.15,190.5 187.96,194.31 203.2,194.31 U$1.GRN_07
GRN_10  (via drill 0.6)
  Top 0.305: GREEN_10.13 19.05,3.81 19.05,17.78 25.4,24.13 v25.4,26.67 | v35.56,36.83 35.56,87.63 31.75,91.44 31.75,162.56 25.4,168.91 U$1.GRN_10
  Bottom 0.305: v35.56,36.83 v25.4,26.67
GRN_11  (via drill 0.6)
  Top 0.305: v21.59,10.16 20.32,11.43 20.32,17.78 26.67,24.13 26.67,36.83 29.21,39.37 v29.21,40.64 | v39.37,49.53 39.37,152.4 50.8,163.83 U$1.GRN_11
  Bottom 0.305: GREEN_10.14 26.67,7.62 24.13,7.62 v21.59,10.16 | v29.21,40.64 33.02,44.45 34.29,44.45 v39.37,49.53
GRN_12  (via drill 0.6)
  Top 0.305: v24.13,15.24 22.86,16.51 22.86,17.78 27.94,22.86 v27.94,30.48 | v33.02,35.56 34.29,36.83 v34.29,45.72 | v38.1,49.53 38.1,157.48 v48.26,167.64
  Bottom 0.305: GREEN_10.15 29.21,8.89 26.67,8.89 25.4,10.16 25.4,15.24 v24.13,15.24 | v33.02,35.56 v27.94,30.48 | v38.1,49.53 v34.29,45.72 | v48.26,167.64 74.93,167.64 76.2,168.91 U$1.GRN_12
GRN_13  (via drill 0.6)
  Top 0.305: v33.02,22.86 v33.02,16.51 | v78.74,166.37 v78.74,25.4
  Bottom 0.305: GREEN_10.16 31.75,8.89 33.02,10.16 v33.02,16.51 | v33.02,22.86 76.2,22.86 v78.74,25.4 | v78.74,166.37 81.28,168.91 101.6,168.91 U$1.GRN_13
GRN_14  (via drill 0.6)
  Top 0.305: v35.56,15.24 35.56,35.56 38.1,38.1 v38.1,41.91 | v62.23,46.99 63.5,48.26 63.5,137.16 62.23,138.43 v62.23,165.1
  Bottom 0.305: GREEN_10.17 34.29,8.89 35.56,10.16 v35.56,15.24 | v38.1,41.91 39.37,43.18 48.26,43.18 52.07,46.99 v62.23,46.99 | v62.23,165.1 78.74,165.1 81.28,167.64 125.73,167.64 127,168.91 U$1.GRN_14
GRN_15  (via drill 0.6)
  Top 0.305: v38.1,15.24 39.37,16.51 v39.37,26.67 | v53.34,29.21 55.88,31.75 v55.88,39.37 | v80.01,165.1 v80.01,39.37
  Bottom 0.305: GREEN_10.18 36.83,8.89 38.1,10.16 v38.1,15.24 | v39.37,26.67 40.64,27.94 44.45,27.94 45.72,29.21 v53.34,29.21 | v80.01,39.37 v55.88,39.37 | v80.01,165.1 81.28,166.37 149.86,166.37 152.4,168.91 U$1.GRN_15
GRN_16  (via drill 0.6)
  Top 0.305: v43.18,15.24 52.07,24.13 52.07,39.37 54.61,41.91 54.61,91.44 55.88,92.71 v55.88,163.83
  Bottom 0.305: GREEN_10.19 39.37,8.89 41.91,8.89 43.18,10.16 v43.18,15.24 | v55.88,163.83 172.72,163.83 177.8,168.91 U$1.GRN_16
GRN_17  (via drill 0.6)
  Top 0.305: v41.91,16.51 41.91,29.21 39.37,31.75 v39.37,48.26 | v100.33,48.26 100.33,66.04 99.06,67.31 99.06,124.46 105.41,130.81 133.35,130.81 133.35,135.89 158.75,161.29 167.64,161.29 167.64,157.48 171.45,153.67 184.15,153.67 v184.15,168.91
  Bottom 0.305: GREEN_10.20 41.91,7.62 43.18,8.89 44.45,7.62 44.45,6.35 45.72,5.08 46.99,6.35 46.99,7.62 45.72,8.89 45.72,16.51 v41.91,16.51 | v100.33,48.26 v39.37,48.26 | v184.15,168.91 203.2,168.91 U$1.GRN_17
GRN_20  (via drill 0.6)
  Top 0.305: v83.82,25.4 v83.82,16.51 | v46.99,25.4 46.99,130.81 48.26,132.08 v48.26,142.24
  Bottom 0.305: GREEN_32.5 92.71,16.51 v83.82,16.51 | v83.82,25.4 82.55,26.67 60.96,26.67 59.69,25.4 v46.99,25.4 | v48.26,142.24 46.99,143.51 25.4,143.51 U$1.GRN_20
GRN_21  (via drill 0.6)
  Top 0.305: v90.17,29.21 v90.17,15.24 | v67.31,29.21 64.77,31.75 v64.77,104.14 | v45.72,109.22 45.72,130.81 46.99,132.08 46.99,142.24 48.26,143.51 50.8,143.51 U$1.GRN_21
  Bottom 0.305: v90.17,15.24 GREEN_32.6 | v67.31,29.21 v90.17,29.21 | v64.77,104.14 50.8,104.14 v45.72,109.22
GRN_22  (via drill 0.6)
  Top 0.305: v87.63,15.24 88.9,16.51 v88.9,25.4 | v97.79,25.4 99.06,26.67 99.06,66.04 97.79,67.31 v97.79,144.78
  Bottom 0.305: v87.63,15.24 GREEN_32.7 | v97.79,25.4 v88.9,25.4 | v97.79,144.78 76.2,144.78 U$1.GRN_22
GRN_23  (via drill 0.6)
  Top 0.305: v86.36,15.24 87.63,16.51 87.63,29.21 90.17,31.75 90.17,80.01 88.9,81.28 v88.9,143.51
  Bottom 0.305: GREEN_32.8 85.09,13.97 v86.36,15.24 | v88.9,143.51 101.6,143.51 U$1.GRN_23
GRN_24  (via drill 0.6)
  Top 0.305: v83.82,15.24 85.09,16.51 85.09,29.21 86.36,30.48 86.36,48.26 87.63,49.53 v87.63,146.05
  Bottom 0.305: GREEN_32.9 82.55,15.24 v83.82,15.24 | v87.63,146.05 88.9,147.32 124.46,147.32 127,144.78 U$1.GRN_24
GRN_25  (via drill 0.6)
  Top 0.305: v81.28,17.78 82.55,19.05 82.55,45.72 86.36,49.53 v86.36,115.57 | v130.81,116.84 152.4,138.43 U$1.GRN_25
  Bottom 0.305: GREEN_32.10 80.01,13.97 81.28,13.97 v81.28,17.78 | v86.36,115.57 87.63,116.84 v130.81,116.84
GRN_26  (via drill 0.6)
  Top 0.305: v77.47,15.24 81.28,19.05 81.28,21.59 80.01,22.86 73.66,22.86 v73.66,104.14 | v168.91,104.14 181.61,116.84 181.61,139.7 177.8,143.51 U$1.GRN_26
  Bottom 0.305: v77.47,15.24 GREEN_32.11 | v168.91,104.14 v73.66,104.14
GRN_27  (via drill 0.6)
  Top 0.305: v67.31,19.05 63.5,22.86 v63.5,46.99 | v82.55,142.24 v82.55,46.99
  Bottom 0.305: v67.31,19.05 GREEN_32.12 | v82.55,46.99 v63.5,46.99 | v82.55,142.24 186.69,142.24 187.96,143.51 203.2,143.51 U$1.GRN_27
GRN_30  (via drill 0.6)
  Top 0.305: v59.69,19.05 55.88,22.86 v55.88,29.21 | v45.72,34.29 45.72,107.95 41.91,111.76 v41.91,127
  Bottom 0.305: v59.69,19.05 GREEN_32.13 | v55.88,29.21 50.8,34.29 v45.72,34.29 | v41.91,127 25.4,127 22.86,124.46 22.86,119.38 25.4,119.38 U$1.GRN_30
GRN_31  (via drill 0.6)
  Top 0.305: v62.23,19.05 60.96,20.32 60.96,45.72 59.69,46.99 59.69,53.34 57.15,55.88 v57.15,118.11
  Bottom 0.305: v62.23,19.05 GREEN_32.14 | v57.15,118.11 50.8,118.11 U$1.GRN_31
GRN_32  (via drill 0.6)
  Top 0.305: v68.58,15.24 71.12,17.78 71.12,113.03 76.2,118.11 U$1.GRN_32
  Bottom 0.305: v68.58,15.24 GREEN_32.15
GRN_32_DATA  (via drill 0.6 pad 1.02)
  Top 0.305: v52.07,13.97 v100.33,13.97
  Bottom 0.61: GREEN_10.22 46.99,5.08 48.26,6.35 48.26,15.24 52.07,15.24 v52.07,13.97 | v100.33,13.97 GREEN_32.2
GRN_33  (via drill 0.6)
  Top 0.305: v74.93,15.24 72.39,17.78 72.39,110.49 v77.47,115.57
  Bottom 0.305: GREEN_32.16 76.2,10.16 76.2,15.24 v74.93,15.24 | v77.47,115.57 80.01,118.11 101.6,118.11 U$1.GRN_33
GRN_34  (via drill 0.6)
  Top 0.305: v86.36,19.05 86.36,29.21 87.63,30.48 87.63,38.1 88.9,39.37 v88.9,46.99 | v125.73,48.26 129.54,52.07 129.54,115.57 127,118.11 U$1.GRN_34
  Bottom 0.305: GREEN_32.17 78.74,10.16 78.74,19.05 v86.36,19.05 | v88.9,46.99 118.11,46.99 119.38,48.26 v125.73,48.26
GRN_35  (via drill 0.6)
  Top 0.305: v85.09,15.24 86.36,16.51 v86.36,17.78 | v91.44,19.05 91.44,66.04 92.71,67.31 92.71,80.01 91.44,81.28 v91.44,115.57
  Bottom 0.305: GREEN_32.18 87.63,8.89 85.09,8.89 83.82,10.16 83.82,13.97 v85.09,15.24 | v86.36,17.78 87.63,19.05 v91.44,19.05 | v91.44,115.57 149.86,115.57 152.4,118.11 U$1.GRN_35
GRN_36  (via drill 0.6)
  Top 0.305: v91.44,15.24 95.25,19.05 v95.25,26.67 | v128.27,26.67 129.54,25.4 130.81,25.4 130.81,106.68 149.86,125.73 177.8,125.73 U$1.GRN_36
  Bottom 0.305: GREEN_32.19 90.17,8.89 91.44,10.16 v91.44,15.24 | v128.27,26.67 v95.25,26.67
GRN_37  (via drill 0.6)
  Top 0.305: v97.79,16.51 104.14,22.86 106.68,22.86 106.68,17.78 109.22,15.24 120.65,15.24 120.65,60.96 v119.38,62.23 | v120.65,63.5 120.65,91.44 128.27,99.06 v128.27,111.76
  Bottom 0.305: GREEN_32.20 92.71,8.89 93.98,10.16 93.98,16.51 v97.79,16.51 | v120.65,63.5 v119.38,62.23 | v128.27,111.76 130.81,114.3 199.39,114.3 203.2,118.11 U$1.GRN_37
GRN_40  (via drill 0.6)
  Top 0.305: v146.05,17.78 v143.51,15.24 | v144.78,19.05 140.97,22.86 140.97,52.07 139.7,53.34 139.7,64.77 148.59,73.66 v148.59,80.01 | v24.13,87.63 25.4,88.9 U$1.GRN_40
  Bottom 0.305: v143.51,15.24 GREEN_54.5 | v144.78,19.05 v146.05,17.78 | v148.59,80.01 64.77,80.01 59.69,85.09 39.37,85.09 34.29,80.01 31.75,80.01 v24.13,87.63
GRN_41  (via drill 0.6)
  Top 0.305: v140.97,15.24 139.7,16.51 v139.7,27.94 | v97.79,27.94 97.79,66.04 96.52,67.31 v96.52,91.44
  Bottom 0.305: v140.97,15.24 GREEN_54.6 | v97.79,27.94 v139.7,27.94 | v96.52,91.44 91.44,96.52 53.34,96.52 50.8,93.98 U$1.GRN_41
GRN_42  (via drill 0.6)
  Top 0.305: v138.43,39.37 v138.43,19.05 | v95.25,91.44 v95.25,39.37
  Bottom 0.305: v138.43,19.05 GREEN_54.7 | v95.25,39.37 v138.43,39.37 | v95.25,91.44 93.98,92.71 76.2,92.71 U$1.GRN_42
GRN_43  (via drill 0.6)
  Top 0.305: v135.89,19.05 137.16,20.32 v137.16,58.42 | v120.65,62.23 114.3,68.58 114.3,83.82 105.41,92.71 101.6,92.71 U$1.GRN_43
  Bottom 0.305: v135.89,19.05 GREEN_54.8 | v137.16,58.42 133.35,62.23 v120.65,62.23
GRN_44  (via drill 0.6)
  Top 0.305: v132.08,15.24 124.46,15.24 124.46,90.17 127,92.71 U$1.GRN_44
  Bottom 0.305: GREEN_54.9 133.35,15.24 v132.08,15.24
GRN_45  (via drill 0.6)
  Top 0.305: v134.62,19.05 133.35,20.32 133.35,59.69 147.32,73.66 147.32,81.28 152.4,86.36 U$1.GRN_45
  Bottom 0.305: GREEN_54.10 130.81,19.05 v134.62,19.05
GRN_46  (via drill 0.6)
  Top 0.305: v123.19,91.44 v123.19,15.24
  Bottom 0.305: GREEN_54.11 125.73,13.97 124.46,13.97 v123.19,15.24 | v123.19,91.44 176.53,91.44 177.8,92.71 U$1.GRN_46
GRN_47  (via drill 0.6)
  Top 0.305: v121.92,91.44 v121.92,15.24
  Bottom 0.305: v121.92,15.24 GREEN_54.12 | v121.92,91.44 127,96.52 200.66,96.52 203.2,93.98 U$1.GRN_47
GRN_50  (via drill 0.6)
  Top 0.305: v107.95,15.24 96.52,15.24 v96.52,59.69 | v69.85,60.96 67.31,63.5 v67.31,64.77
  Bottom 0.305: GREEN_54.13 114.3,15.24 v107.95,15.24 | v96.52,59.69 95.25,60.96 v69.85,60.96 | v67.31,64.77 34.29,64.77 31.75,67.31 25.4,67.31 U$1.GRN_50
GRN_51  (via drill 0.6)
  Top 0.305: v114.3,17.78 114.3,60.96 v109.22,66.04
  Bottom 0.305: v114.3,17.78 GREEN_54.14 | v109.22,66.04 93.98,66.04 90.17,69.85 77.47,69.85 76.2,71.12 53.34,71.12 50.8,68.58 U$1.GRN_51
GRN_52  (via drill 0.6)
  Top 0.305: v115.57,62.23 v115.57,17.78 | v77.47,63.5 76.2,64.77 U$1.GRN_52
  Bottom 0.305: GREEN_54.15 116.84,17.78 v115.57,17.78 | v115.57,62.23 114.3,63.5 v77.47,63.5
GRN_53  (via drill 0.6)
  Top 0.305: v113.03,19.05 104.14,27.94 104.14,64.77 101.6,67.31 U$1.GRN_53
  Bottom 0.305: GREEN_54.16 133.35,8.89 130.81,8.89 129.54,10.16 129.54,15.24 124.46,15.24 120.65,19.05 v113.03,19.05
GRN_54  (via drill 0.6)
  Top 0.305: v134.62,17.78 132.08,20.32 v132.08,66.04
  Bottom 0.305: GREEN_54.17 135.89,8.89 134.62,10.16 v134.62,17.78 | v132.08,66.04 130.81,67.31 127,67.31 U$1.GRN_54
GRN_54_DATA  (via drill 0.6 pad 1.02)
  Top 0.305: v102.87,13.97 v151.13,13.97
  Bottom 0.61: GREEN_32.22 97.79,5.08 99.06,6.35 99.06,15.24 102.87,15.24 v102.87,13.97 | v151.13,13.97 GREEN_54.2
GRN_55  (via drill 0.6)
  Top 0.305: v147.32,16.51 149.86,19.05 149.86,31.75 157.48,39.37 157.48,62.23 152.4,67.31 U$1.GRN_55
  Bottom 0.305: GREEN_54.18 138.43,8.89 139.7,10.16 139.7,16.51 v147.32,16.51
GRN_56  (via drill 0.6)
  Top 0.305: v142.24,15.24 147.32,20.32 147.32,69.85 157.48,80.01 177.8,80.01 U$1.GRN_56
  Bottom 0.305: GREEN_54.19 140.97,8.89 142.24,10.16 v142.24,15.24
GRN_57  (via drill 0.6)
  Top 0.305: v144.78,15.24 148.59,19.05 v148.59,63.5
  Bottom 0.305: GREEN_54.20 143.51,8.89 144.78,10.16 v144.78,15.24 | v148.59,63.5 204.47,63.5 205.74,64.77 205.74,67.31 203.2,67.31 U$1.GRN_57
GRN_60  (via drill 0.6)
  Top 0.305: v194.31,19.05 198.12,22.86 v198.12,66.04 | v34.29,73.66 31.75,71.12 v31.75,66.04 | v27.94,64.77 27.94,45.72 25.4,43.18 U$1.GRN_60
  Bottom 0.305: v194.31,19.05 GREEN_76.5 | v198.12,66.04 138.43,66.04 132.08,72.39 88.9,72.39 87.63,73.66 v34.29,73.66 | v31.75,66.04 30.48,64.77 v27.94,64.77
GRN_61  (via drill 0.6)
  Top 0.305: v191.77,16.51 190.5,17.78 v190.5,31.75 | v49.53,36.83 49.53,40.64 50.8,41.91 U$1.GRN_61
  Bottom 0.305: v191.77,16.51 GREEN_76.6 | v190.5,31.75 186.69,35.56 143.51,35.56 142.24,34.29 67.31,34.29 64.77,36.83 v49.53,36.83
GRN_62  (via drill 0.6)
  Top 0.305: v187.96,15.24 186.69,16.51 v186.69,21.59 | v78.74,24.13 76.2,26.67 U$1.GRN_62
  Bottom 0.305: GREEN_76.7 189.23,15.24 v187.96,15.24 | v186.69,21.59 185.42,22.86 153.67,22.86 152.4,24.13 118.11,24.13 116.84,25.4 99.06,25.4 97.79,24.13 v78.74,24.13
GRN_63  (via drill 0.6)
  Top 0.305: v186.69,15.24 185.42,16.51 185.42,29.21 182.88,31.75 182.88,40.64 177.8,45.72 170.18,45.72 v170.18,38.1 | v102.87,38.1 101.6,39.37 U$1.GRN_63
  Bottom 0.305: v186.69,15.24 GREEN_76.8 | v102.87,38.1 v170.18,38.1
GRN_64  (via drill 0.6)
  Top 0.305: v184.15,25.4 v184.15,15.24 | v129.54,26.67 127,29.21 U$1.GRN_64
  Bottom 0.305: v184.15,15.24 GREEN_76.9 | v184.15,25.4 182.88,26.67 v129.54,26.67
GRN_65  (via drill 0.6)
  Top 0.305: v181.61,15.24 181.61,27.94 180.34,29.21 v180.34,40.64
  Bottom 0.305: v181.61,15.24 GREEN_76.10 | v180.34,40.64 168.91,40.64 167.64,41.91 152.4,41.91 U$1.GRN_65
GRN_66  (via drill 0.6)
  Top 0.305: v180.34,15.24 180.34,27.94 177.8,30.48 U$1.GRN_66
  Bottom 0.305: GREEN_76.11 179.07,13.97 v180.34,15.24
GRN_67  (via drill 0.6)
  Top 0.305: v187.96,25.4 v187.96,16.51 | U$1.GRN_67 v203.2,25.4
  Bottom 0.305: 203.2,43.18 U$1.GRN_67 | GREEN_76.12 176.53,15.24 179.07,15.24 180.34,16.51 v187.96,16.51 | v203.2,25.4 v187.96,25.4
GRN_70  (via drill 0.6)
  Top 0.305: v165.1,15.24 162.56,17.78 v162.56,52.07 | v113.03,52.07 107.95,46.99 v107.95,33.02 | v30.48,24.13 25.4,19.05 U$1.GRN_70
  Bottom 0.305: v165.1,15.24 GREEN_76.13 | v113.03,52.07 v162.56,52.07 | v107.95,33.02 104.14,29.21 95.25,29.21 93.98,27.94 60.96,27.94 59.69,26.67 45.72,26.67 43.18,24.13 v30.48,24.13
GRN_71  (via drill 0.6)
  Top 0.305: v167.64,15.24 163.83,19.05 v163.83,48.26 | v58.42,49.53 57.15,48.26 57.15,31.75 53.34,27.94 53.34,20.32 50.8,17.78 U$1.GRN_71
  Bottom 0.305: v167.64,15.24 GREEN_76.14 | v163.83,48.26 162.56,49.53 v58.42,49.53
GRN_72  (via drill 0.6)
  Top 0.305: v168.91,15.24 166.37,17.78 v166.37,39.37 | v113.03,40.64 111.76,39.37 v111.76,22.86 | v80.01,21.59 76.2,17.78 U$1.GRN_72
  Bottom 0.305: GREEN_76.15 177.8,7.62 176.53,7.62 v168.91,15.24 | v166.37,39.37 139.7,39.37 138.43,40.64 v113.03,40.64 | v111.76,22.86 101.6,22.86 100.33,21.59 v80.01,21.59
GRN_73  (via drill 0.6)
  Top 0.305: v152.4,22.86 v158.75,16.51 | v105.41,21.59 101.6,17.78 U$1.GRN_73
  Bottom 0.305: GREEN_76.16 179.07,8.89 176.53,8.89 173.99,11.43 173.99,16.51 v158.75,16.51 | v152.4,22.86 113.03,22.86 111.76,21.59 v105.41,21.59
GRN_74  (via drill 0.6)
  Top 0.305: v182.88,21.59 v182.88,15.24 | v129.54,21.59 127,19.05 U$1.GRN_74
  Bottom 0.305: GREEN_76.17 186.69,8.89 184.15,8.89 182.88,10.16 v182.88,15.24 | v129.54,21.59 v182.88,21.59
GRN_75  (via drill 0.6)
  Top 0.305: v190.5,16.51 189.23,17.78 v189.23,26.67 | v156.21,27.94 151.13,22.86 151.13,19.05 152.4,17.78 U$1.GRN_75
  Bottom 0.305: GREEN_76.18 189.23,8.89 190.5,10.16 v190.5,16.51 | v189.23,26.67 187.96,27.94 v156.21,27.94
GRN_76
  Bottom 0.305: GREEN_76.19 191.77,8.89 193.04,10.16 193.04,17.78 177.8,17.78 U$1.GRN_76
GRN_76_DATA  (via drill 0.6 pad 1.02)
  Top 0.305: v153.67,13.97 v201.93,13.97
  Bottom 0.61: GREEN_54.22 148.59,5.08 149.86,6.35 149.86,15.24 153.67,15.24 v153.67,13.97 | v201.93,13.97 GREEN_76.2
GRN_77
  Bottom 0.305: GREEN_76.20 194.31,8.89 195.58,10.16 195.58,16.51 203.2,16.51 U$1.GRN_77
GRN_OUT  (via drill 0.6 pad 1.02)
  Top 0.305: v211.46,203.2 v207.65,203.2 | v207.65,21.59 v207.65,18.41
  Bottom 0.61: RED_10.2 v211.46,203.2 | v207.65,203.2 v207.65,21.59 | v207.65,18.41 204.47,15.24 200.66,15.24 200.66,6.35 199.39,5.08 GREEN_76.22
LATCH  (via drill 0.6, 0.6 pad 1.02)
  Top 0.305: v6.35,184.15 v6.35,133.35 v6.35,82.55 v6.35,31.75 v6.35,15.24 | v20.95,6.35 v45.72,6.35 v96.52,6.35 v147.32,6.35 v198.12,6.35 v214.63,6.35 | v222.25,21.59 v222.25,46.99 v222.25,97.79 v222.25,148.59 v222.25,199.39 v222.25,215.9
  Bottom 0.61: BLU_10.4 10.16,185.42 8.89,184.15 v6.35,184.15 | v6.35,133.35 8.89,133.35 10.16,134.62 BLU_32.4 | v6.35,31.75 8.26,31.75 9.53,33.02 BLU_76.4 | v6.35,82.55 8.89,82.55 10.16,83.82 BLU_54.4 | GREEN_10.4 44.45,8.89 45.72,7.62 v45.72,6.35 | v20.95,6.35 10.79,6.35 6.35,10.79 v6.35,15.24 | GREEN_32.4 95.25,8.89 96.52,7.62 v96.52,6.35 | GREEN_54.4 146.05,9.53 147.32,8.26 v147.32,6.35 | GREEN_76.4 196.85,8.89 198.12,7.62 v198.12,6.35 | RED_76.4 219.71,45.72 220.98,46.99 v222.25,46.99 | v222.25,21.59 222.25,12.7 215.9,6.35 v214.63,6.35 | RED_54.4 219.71,96.52 220.98,97.79 v222.25,97.79 | RED_32.4 219.71,147.32 220.98,148.59 v222.25,148.59 | RED_10.4 219.71,198.12 220.98,199.39 v222.25,199.39 | SV1.3 162.56,222.25 164.47,220.34 219.71,220.34 222.25,217.81 v222.25,215.9
N$1
  Bottom 0.61: R5.2 49.53,7.62 GREEN_10.23
N$3
  Bottom 0.61: R6.2 100.81,7.47 100.33,6.99 GREEN_32.23
N$4
  Bottom 0.61: GREEN_54.23 151.13,7.14 R7.2
N$5
  Bottom 0.61: R8.2 202.41,6.83 201.93,6.35 GREEN_76.23
N$6
  Bottom 0.61: BLU_10.23 7.14,180.34 R9.2
N$7
  Bottom 0.61: R10.2 7.14,129.54 BLU_32.23
N$8
  Bottom 0.61: R11.2 7.62,78.11 6.99,78.74 BLU_54.23
N$9
  Bottom 0.61: R12.2 7.47,27.46 6.99,27.94 BLU_76.23
N$13
  Bottom 0.61: R1.2 221.13,203.68 221.62,203.2 RED_10.23
N$14
  Bottom 0.61: R2.2 221.13,152.88 221.62,152.4 RED_32.23
N$15
  Bottom 0.61: R3.2 221.13,102.08 221.62,101.6 RED_54.23
N$18
  Bottom 0.61: R4.2 221.13,51.28 221.62,50.8 RED_76.23
RED_00  (via drill 0.6)
  Top 0.305: v210.82,195.58 205.74,195.58 v205.74,199.39
  Bottom 0.305: v210.82,195.58 RED_10.5 | v205.74,199.39 205.74,214.63 39.37,214.63 34.29,209.55 U$1.RED_00
RED_01  (via drill 0.6)
  Top 0.305: v213.36,193.04 213.36,210.82 208.28,215.9 57.15,215.9 v57.15,212.09
  Bottom 0.305: v213.36,193.04 RED_10.6 | v57.15,212.09 59.69,209.55 U$1.RED_01
RED_02  (via drill 0.6)
  Top 0.305: v213.36,191.77 212.09,193.04 212.09,196.85 v204.47,204.47 | v90.17,212.09 85.09,212.09 85.09,209.55 U$1.RED_02
  Bottom 0.305: RED_10.7 215.9,191.77 v213.36,191.77 | v204.47,204.47 196.85,212.09 v90.17,212.09
RED_03  (via drill 0.6)
  Top 0.305: v213.36,187.96 210.82,190.5 v203.2,190.5 | v127,189.23 110.49,205.74 110.49,208.28 U$1.RED_03
  Bottom 0.305: v213.36,187.96 RED_10.8 | v203.2,190.5 201.93,191.77 186.69,191.77 184.15,189.23 v127,189.23
RED_04  (via drill 0.6)
  Top 0.305: v204.47,186.69 v210.82,186.69 | v165.1,186.69 144.78,207.01 135.89,207.01 135.89,208.28 U$1.RED_04
  Bottom 0.305: RED_10.9 213.36,185.42 212.09,186.69 v210.82,186.69 | v165.1,186.69 v204.47,186.69
RED_05  (via drill 0.6)
  Top 0.305: v213.36,182.88 212.09,181.61 212.09,179.07 210.82,177.8 v203.2,177.8 | v186.69,180.34 161.29,205.74 161.29,208.28 U$1.RED_05
  Bottom 0.305: v213.36,182.88 RED_10.10 | v203.2,177.8 200.66,180.34 v186.69,180.34
RED_06  (via drill 0.6)
  Top 0.305: v210.82,180.34 203.2,180.34 v203.2,189.23 | v198.12,190.5 186.69,201.93 186.69,208.28 U$1.RED_06
  Bottom 0.305: v210.82,180.34 RED_10.11 | v203.2,189.23 201.93,190.5 v198.12,190.5
RED_07  (via drill 0.6)
  Top 0.305: RED_10.12 215.9,176.53 215.9,158.75 213.36,156.21 205.74,156.21 v205.74,157.48 | v199.39,179.07 199.39,200.66 207.01,208.28 210.82,208.28 U$1.RED_07
  Bottom 0.305: v205.74,157.48 205.74,176.53 203.2,176.53 200.66,179.07 v199.39,179.07
RED_10  (via drill 0.6)
  Top 0.305: v210.82,172.72 186.69,172.72 144.78,214.63 58.42,214.63 58.42,212.09 43.18,196.85 v43.18,187.96
  Bottom 0.305: RED_10.13 219.71,172.72 v210.82,172.72 | v43.18,187.96 39.37,184.15 34.29,184.15 U$1.RED_10
RED_11  (via drill 0.6)
  Top 0.305: v213.36,176.53 210.82,173.99 203.2,173.99 v203.2,175.26 | v63.5,176.53 59.69,180.34 59.69,182.88 U$1.RED_11
  Bottom 0.305: RED_10.14 220.98,176.53 v213.36,176.53 | v203.2,175.26 201.93,176.53 v63.5,176.53
RED_12  (via drill 0.6)
  Top 0.305: v210.82,179.07 201.93,179.07 v201.93,173.99 | v82.55,173.99 83.82,175.26 83.82,182.88 U$1.RED_12
  Bottom 0.305: RED_10.15 220.98,179.07 v210.82,179.07 | v82.55,173.99 v201.93,173.99
RED_13  (via drill 0.6)
  Top 0.305: v210.82,181.61 208.28,181.61 v205.74,184.15 | v118.11,181.61 110.49,181.61 110.49,182.88 U$1.RED_13
  Bottom 0.305: RED_10.16 222.25,182.88 219.71,182.88 218.44,181.61 v210.82,181.61 | v205.74,184.15 203.2,181.61 v118.11,181.61
RED_14  (via drill 0.6)
  Top 0.305: v205.74,187.96 v210.82,187.96 | v143.51,191.77 135.89,184.15 U$1.RED_14
  Bottom 0.305: RED_10.17 223.52,186.69 213.36,186.69 212.09,187.96 v210.82,187.96 | v205.74,187.96 205.74,198.12 184.15,198.12 177.8,191.77 v143.51,191.77
RED_15  (via drill 0.6)
  Top 0.305: v204.47,189.23 v210.82,189.23
  Bottom 0.305: RED_10.18 223.52,189.23 v210.82,189.23 | v204.47,189.23 203.2,187.96 165.1,187.96 161.29,184.15 U$1.RED_15
RED_16  (via drill 0.6)
  Top 0.305: v210.82,194.31 205.74,194.31 201.93,190.5 201.93,182.88 200.66,181.61 200.66,179.07 199.39,177.8 187.96,177.8 187.96,181.61 186.69,182.88 U$1.RED_16
  Bottom 0.305: RED_10.19 223.52,194.31 v210.82,194.31
RED_17  (via drill 0.6)
  Top 0.305: v210.82,196.85 207.01,200.66 200.66,200.66 v200.66,185.42 | v205.74,185.42 210.82,185.42 210.82,184.15 U$1.RED_17
  Bottom 0.305: RED_10.20 219.71,195.58 218.44,196.85 v210.82,196.85 | v205.74,185.42 v200.66,185.42
RED_20  (via drill 0.6)
  Top 0.305: v203.2,157.48 v210.82,149.86 | v38.1,172.72 34.29,168.91 34.29,158.75 U$1.RED_20
  Bottom 0.305: RED_32.5 212.09,149.86 v210.82,149.86 | v203.2,157.48 193.04,167.64 182.88,167.64 177.8,172.72 v38.1,172.72
RED_21  (via drill 0.6)
  Top 0.305: v210.82,142.24 205.74,147.32 v205.74,151.13 | v171.45,154.94 v177.8,161.29
  Bottom 0.305: v210.82,142.24 RED_32.6 | v205.74,151.13 195.58,161.29 v177.8,161.29 | v171.45,154.94 62.23,154.94 59.69,157.48 U$1.RED_21
RED_22  (via drill 0.6)
  Top 0.305: v210.82,139.7 207.01,143.51 207.01,144.78 v205.74,146.05
  Bottom 0.305: v210.82,139.7 RED_32.7 | v205.74,146.05 195.58,156.21 177.8,156.21 172.72,161.29 87.63,161.29 85.09,158.75 U$1.RED_22
RED_23  (via drill 0.6)
  Top 0.305: v213.36,135.89 212.09,137.16 212.09,147.32 v201.93,157.48 | v114.3,162.56 110.49,158.75 U$1.RED_23
  Bottom 0.305: RED_32.8 214.63,137.16 v213.36,135.89 | v201.93,157.48 196.85,162.56 v114.3,162.56
RED_24  (via drill 0.6)
  Top 0.305: v213.36,133.35 213.36,132.08 210.82,129.54 207.01,129.54 v205.74,130.81 | v180.34,152.4 v196.85,135.89
  Bottom 0.305: RED_32.9 214.63,134.62 v213.36,133.35 | v205.74,130.81 200.66,135.89 v196.85,135.89 | v180.34,152.4 176.53,156.21 137.16,156.21 135.89,157.48 U$1.RED_24
RED_25  (via drill 0.6)